# EAGLE schematic Board_760032v2 (EAGLE 9.6.2)
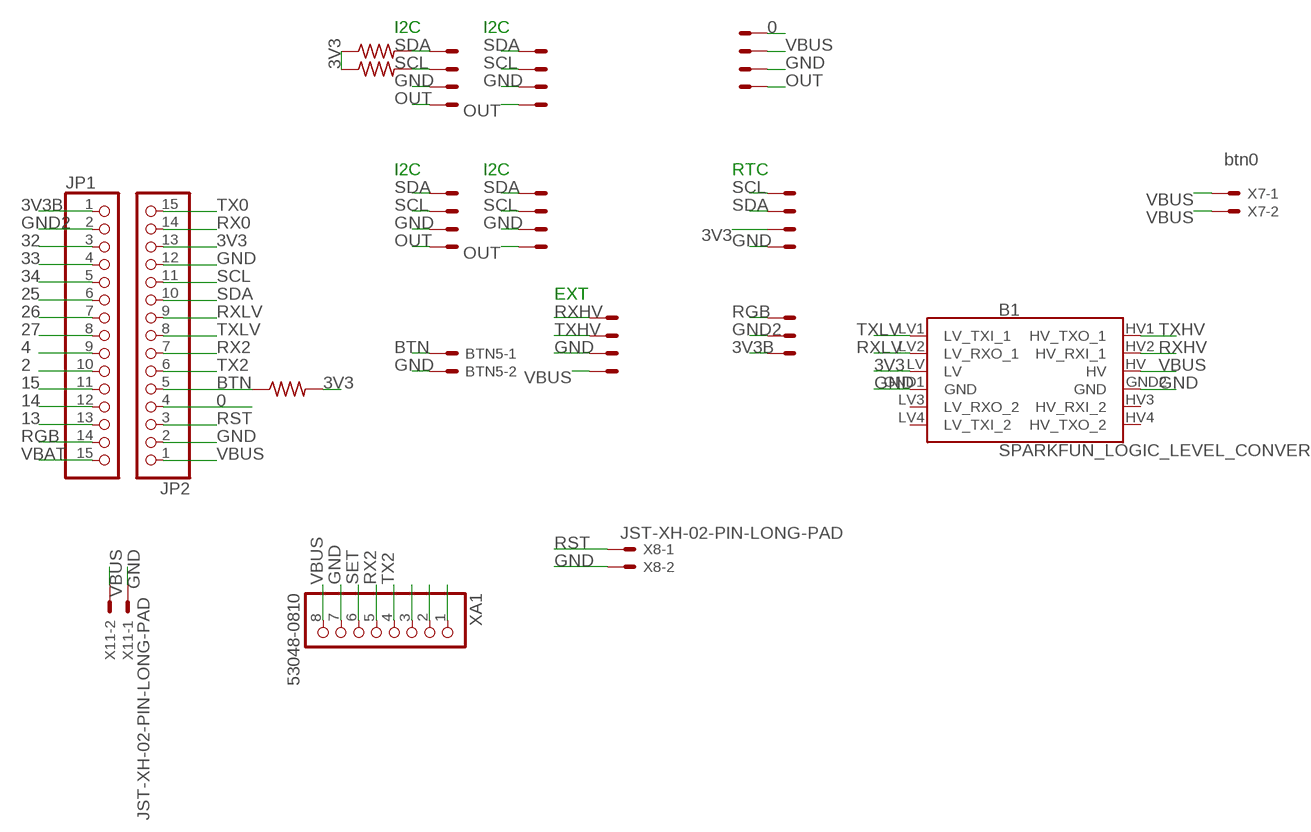
[diagram p0: schematic, sheet 1]

## Parts
B1  SPARKFUN_LOGIC_LEVEL_CONVERTER  [SPARKFUN_LOGIC_LEVEL_CONVERTER]
BTN5  JST-XH-02-PIN-LONG-PAD  [JST-XH-02-PACKAGE-LONG-PAD]
JP1  PINHD-1X15  [1X15]
JP2  PINHD-1X15  [1X15]
R1  R-US_0207/7  [0207/7]
R2  R-US_0207/7  [0207/7]
R3  R-US_0207/7  [0207/7]
RTC  JST-XH-04-PIN-LONG-PAD  [JST-XH-04-PACKAGE-LONG-PAD]
X1  JST-XH-04-PIN-LONG-PAD  [JST-XH-04-PACKAGE-LONG-PAD]
X2  JST-XH-04-PIN-LONG-PAD  [JST-XH-04-PACKAGE-LONG-PAD]
X3  JST-XH-04-PIN-LONG-PAD  [JST-XH-04-PACKAGE-LONG-PAD]
X4  JST-XH-03-PIN-LONG-PAD  [JST-XH-03-PACKAGE-LONG-PAD]
X6  JST-XH-04-PIN-LONG-PAD  [JST-XH-04-PACKAGE-LONG-PAD]
X7  btn0  JST-XH-02-PIN-LONG-PAD  [JST-XH-02-PACKAGE-LONG-PAD]
X8  JST-XH-02-PIN-LONG-PAD  [JST-XH-02-PACKAGE-LONG-PAD]
X9  JST-XH-04-PIN-LONG-PAD  [JST-XH-04-PACKAGE-LONG-PAD]
X10  JST-XH-04-PIN-LONG-PAD  [JST-XH-04-PACKAGE-LONG-PAD]
X11  JST-XH-02-PIN-LONG-PAD  [JST-XH-02-PACKAGE-LONG-PAD]
XA1  53048-0810  [MOLEX_53048-0810]

## Nets
0: JP2.4 X10.4
2: JP1.10
3V3: B1.LV JP2.13 R1.2 R2.1 R3.1 RTC.3
3V3B: JP1.1 X4.3
4: JP1.9
13: JP1.13
14: JP1.12
15: JP1.11
25: JP1.6
26: JP1.7
27: JP1.8
32: JP1.3
33: JP1.4
34: JP1.5
BTN: BTN5.1 JP2.5 R1.1
GND: B1.GND1(GND) B1.GND2(GND) BTN5.2 JP2.2 JP2.12 RTC.4 X1.3 X2.3 X3.3 X6.3 X8.2 X9.3 X10.2 X11.1 XA1.7
GND2: JP1.2 X4.2
N$6: XA1.3
N$7: XA1.2
N$8: XA1.1
OUT: X1.4 X2.4 X3.4 X9.4 X10.1
RGB: JP1.14 X4.1
RST: JP2.3 X8.1
RX0: JP2.14
RX2: JP2.7 XA1.5
RXHV: B1.HV2(HV_RXI_1) X6.1
RXLV: B1.LV2(LV_RXO_1) JP2.9
SCL: JP2.11 R3.2 RTC.1 X1.2 X2.2 X3.2 X9.2
SDA: JP2.10 R2.2 RTC.2 X1.1 X2.1 X3.1 X9.1
SET: XA1.6
TX0: JP2.15
TX2: JP2.6 XA1.4
TXHV: B1.HV1(HV_TXO_1) X6.2
TXLV: B1.LV1(LV_TXI_1) JP2.8
VBAT: JP1.15
VBUS: B1.HV JP2.1 X6.4 X7.1 X7.2 X10.3 X11.2 XA1.8
Unconnected: B1.HV3(HV_RXI_2) B1.HV4(HV_TXO_2) B1.LV3(LV_RXO_2) B1.LV4(LV_TXI_2)

## Notes on the sheet
- I2C | I2C
- I2C | I2C | RTC
- EXT

## Library data of the parts
B1 = Arduino pcbs:SPARKFUN_LOGIC_LEVEL_CONVERTER: SparkFun Logic Level Converter -Bi-Directional This is the mechnical outline for the 3.3V - 5V bi directional logic level converter. *Note, the "LOCK" Package has the header pins staggered by an offset of 5 mils (off center line), so that when you slide a row of standard 0.1" headers into the PTH pads, it will hold position vertically. See the follwing turorial for more information on this type of special footprints: Sneaky Footprints <https://www.sparkfun.com/tutorials/114> SparkFun Products: SparkFun Logic Level Converter - Bi-Directional <https://www.sparkfun.com/products/12009>
BTN5 X7 X8 X11 = Rembrandt Electronics - JST XH Connectors v1-0:JST-XH-02-PIN: JST XH Connector 2 Pin Wire to board connector. Pitch: 2,54 mm, (0.100") Number of pins: 2 Created by Rembrandt Electronics www.rembrandtelectronics.com
JP1 JP2 = pinhead:PINHD-1X15: PIN HEADER
R1-R3 = rcl:R-US_: RESISTOR, American symbol; SPICEPREFIX: R
RTC X1-X3 X6 X9 X10 = Rembrandt Electronics - JST XH Connectors v1-0:JST-XH-04-PIN: JST XH Connector 2 Pin Wire to board connector. Pitch: 2,54 mm, (0.100") Number of pins: 4 Created by Rembrandt Electronics www.rembrandtelectronics.com
X4 = Rembrandt Electronics - JST XH Connectors v1-0:JST-XH-03-PIN: JST XH Connector 2 Pin Wire to board connector. Pitch: 2,54 mm, (0.100") Number of pins: 3 Created by Rembrandt Electronics www.rembrandtelectronics.com
XA1 = ConectorPlantower:53048-0810: 1.25mm Pitch PicoBlade Header, Right Angle, 8 Circuits Check availability <https://pricing.snapeda.com/parts/53048-0810/Molex/view-part?ref=eda>; AVAILABILITY: In Stock; CHECK_PRICES: https://www.snapeda.com/parts/53048-0810/Molex/view-part/?ref=eda; DESCRIPTION: 8 way through board PCB 90deg header | Molex Incorporated 53048-0810; MF: Molex; MP: 53048-0810; PACKAGE: None; PRICE: None; PURCHASE-URL: https://www.snapeda.com/api/url_track_click_mouser/?unipart_id=53851&manufacturer=Molex&part_name=53048-0810&search_term=picoblade 1.25mm header rightangle 8way; SNAPEDA_LINK: https://www.snapeda.com/parts/53048-0810/Molex/view-part/?ref=snap